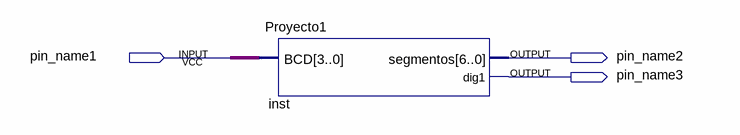
[diagram p0: schematic sheet]
// Quartus schematic Tarea_OyAC.bdf as structural Verilog: 1 symbols, 3 pins
module Tarea_OyAC (
  input  pin_name1,
  output pin_name2,
  output pin_name3
);

  wire [3:0] undriven;

  Proyecto1 inst (.BCD(undriven), .segmentos(pin_name2), .dig1(pin_name3));
endmodule
